# EAGLE design AAA_Battery_Shield (EAGLE 6.4)

## Sheet 1 of 2
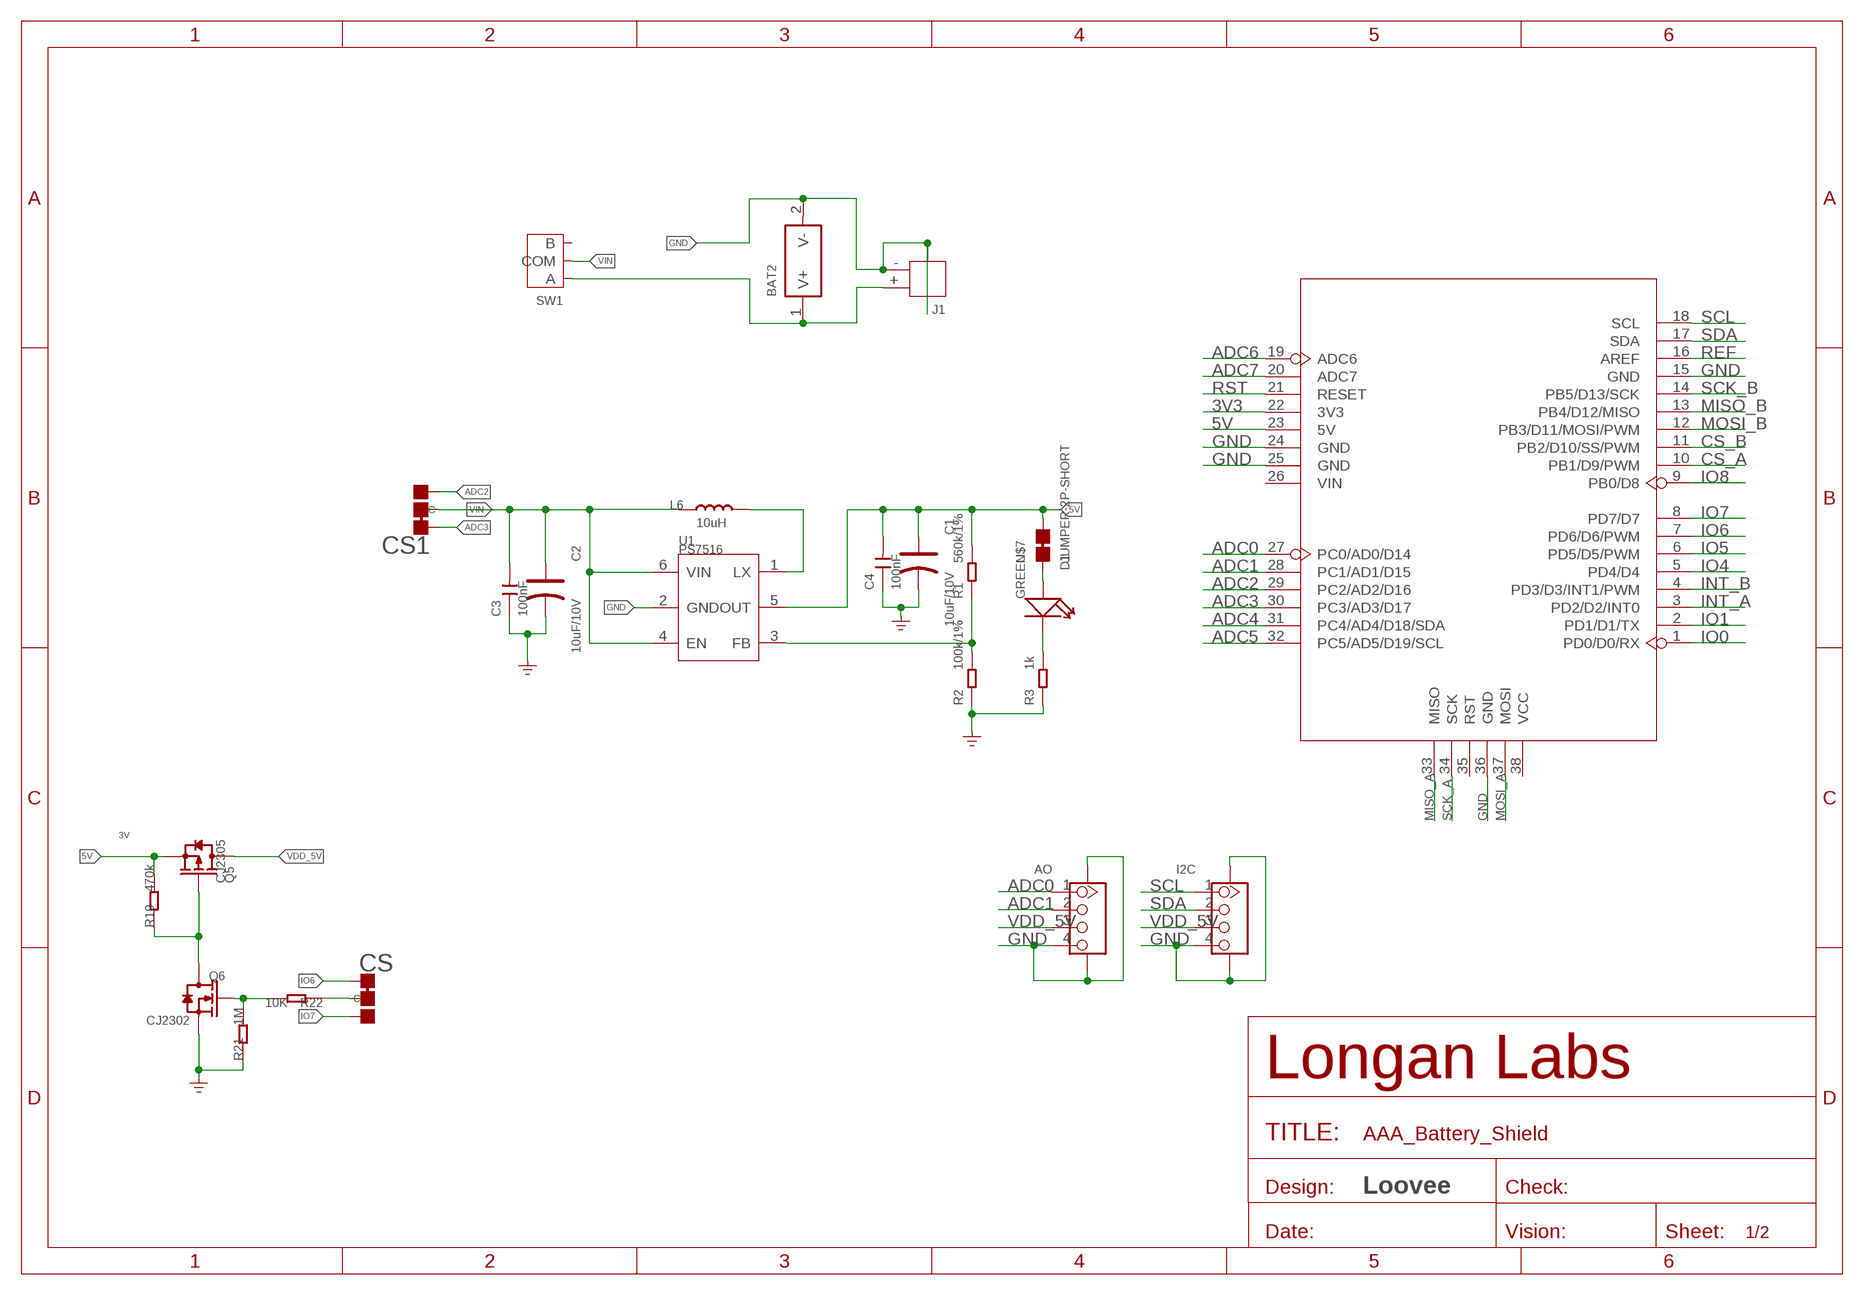
[diagram p0: schematic, sheet 1]

### Parts
AO  GROVE-CONNECTOR-SMD'90D'  [HW4-SMD-2.0-90D]
BAT2  BAT-HOLDER-BC2AAA  [BAT2P-12.5-51.8X24MM]
C1  10uF/10V  CAP-POLAR-AVX-B  [AVX-B]
C2  10uF/10V  CAP-POLAR-AVX-B  [AVX-B]
C3  100nF  CAP-0603  [C0603]
C4  100nF  CAP-0603  [C0603]
CS  JUMPER-3P-SHORT  [3P-SMD-SHORT]
CS1  JUMPER-3P-SHORT  [3P-SMD-SHORT]
D1  GREEN  LED'0603'  [LED-0603]
I2C  GROVE-CONNECTOR-SMD'90D'  [HW4-SMD-2.0-90D]
J1  JST-2P-SMD'2.0'  [HW2-SMD-2.0-90D]
L6  10uH  LSPD3D16-4R7M  [L0420]
Q5  CJ2305  MOSFET-P'SI2323CDS/SI2305DS<BR>'  [SOT-23]
Q6  CJ2302  MOSFET-N'SOT23'  [SOT-23]
R1  560k/1%  RES-0603  [R0603]
R2  100k/1%  RES-0603  [R0603]
R3  1k  RES-0603  [R0603]
R19  470k  RES-0603  [R0603]
R21  1M  RES-0603  [R0603]
R22  10K  RES-0603  [R0603]
SW1  SWITCH-2H-3P  [SW3-2.5-9X3.5MM]
U1  PS7516  PMIC-PS7516  [SOT-23-6]
U4  ARDUINO-38P'WITH/-SILK'  [ARDUINO-38P-WITH/-SILK-500519002]
U$7  JUMPER-2P-SHORT  [2P-SMD-SHORT]

### Nets
3V3: U4.22(3V3)
5V: C1.+ C4.2 Q5.2(S) R1.2 R19.2 U1.5(OUT) U4.23(5V) U$7.2
ADC0: AO.1 U4.27(PC0/AD0/D14)
ADC1: AO.2 U4.28(PC1/AD1/D15)
ADC2: CS1.00(R) U4.29(PC2/AD2/D16)
ADC3: CS1.11(L) U4.30(PC3/AD3/D17)
ADC4: U4.31(PC4/AD4/D18/SDA)
ADC5: U4.32(PC5/AD5/D19/SCL)
ADC6: U4.19(ADC6)
ADC7: U4.20(ADC7)
CS_A: U4.10(PB1/D9/PWM)
CS_B: U4.11(PB2/D10/SS/PWM)
GND: AO.4 AO.SS1 AO.SS2 BAT2.2(V-) C1.- C2.- C3.1 C4.1 I2C.4 I2C.SS1 I2C.SS2 J1.3 J1.4 J1.- Q6.2(S) R2.1 R3.1 R21.1 U1.2(GND) U4.15(GND) U4.24(GND) U4.25(GND) U4.36(GND) ; supply symbol labelled GND_POWER
INT_A: U4.3(PD2/D2/INT0)
INT_B: U4.4(PD3/D3/INT1/PWM)
IO0: U4.1(PD0/D0/RX)
IO1: U4.2(PD1/D1/TX)
IO4: U4.5(PD4/D4)
IO5: U4.6(PD5/D5/PWM)
IO6: CS.11(L) U4.7(PD6/D6/PWM)
IO7: CS.00(R) U4.8(PD7/D7)
IO8: U4.9(PB0/D8)
MISO_A: U4.33(MISO)
MISO_B: U4.13(PB4/D12/MISO)
MOSI_A: U4.37(MOSI)
MOSI_B: U4.12(PB3/D11/MOSI/PWM)
N$1: BAT2.1(V+) J1.+ SW1.1(A)
N$2: CS.MM(C) R22.1
N$3: D1.- R3.2
N$4: L6.2 U1.1(LX)
N$5: D1.+ U$7.1
N$7: R1.1 R2.2 U1.3(FB)
N$15: Q5.1(G) Q6.3(D) R19.1
N$20: Q6.1(G) R21.2 R22.2
REF: U4.16(AREF)
RST: U4.21(RESET)
SCK_A: U4.34(SCK)
SCK_B: U4.14(PB5/D13/SCK)
SCL: I2C.1 U4.18(SCL)
SDA: I2C.2 U4.17(SDA)
VDD_5V: AO.3 I2C.3 Q5.3(D)
VIN: C2.+ C3.2 CS1.MM(C) L6.1 SW1.2(COM) U1.4(EN) U1.6(VIN)
Unconnected: SW1.3(B) U4.26(VIN) U4.35(RST) U4.38(VCC)

### Notes on the sheet
- 3V
- Loovee

## Sheet 2 of 2

## Library data of the parts
AO I2C = Connector-new:GROVE-CONNECTOR-SMD: 4P-SMD-2.0:320110030;4P-SMD-2.0-90D:320110032
BAT2 = Connector-new:BAT-HOLDER: BAT2P-13.5-CR1220:320170002;BAT2P-SMD-20.5-CR1632:320170007;METAL-CR2032-D20.0*H6.3MM:320170003;METAL-CR2032-SMD:320170006;PLASTIC-CR1220-L15.06*W13.0*H4.1MM:320170000;PLASTIC-CR2032-L25.2*W15.6*H5.2MM:320170005;BAT2P-11.55-D12.55-CR1220:313010022
C1 C2 = Discrete-new:CAP-POLAR: Electrolytic Capacitors,Tantalum Capacitors and Super Capacitors
C3 C4 = Discrete-new:CAP: Ceramic Capacitors
CS CS1 = Discrete-new:JUMPER-3P-SHORT
D1 = Discrete-new:LED
J1 = Connector-new:JST-2P-SMD: 2P-SMD-1.0-90D:320110054;2P-SMD-2.0-90D:320110026
L6 = Discrete-new:L
Q5 = Discrete-new:MOSFET-P
Q6 = Discrete-new:MOSFET-N: IRLL014: http://www.vishay.com/docs/91319/sihll014.pdf
R1-R3 R19 R21 R22 = Discrete-new:RES
SW1 = SWITCH:SWITCH-2H-3P
U1 = Longan-IC:PMIC-PS7516
U4 = moudle:ARDUINO-38P
U$7 = Discrete-new:JUMPER-2P-SHORT

## Board
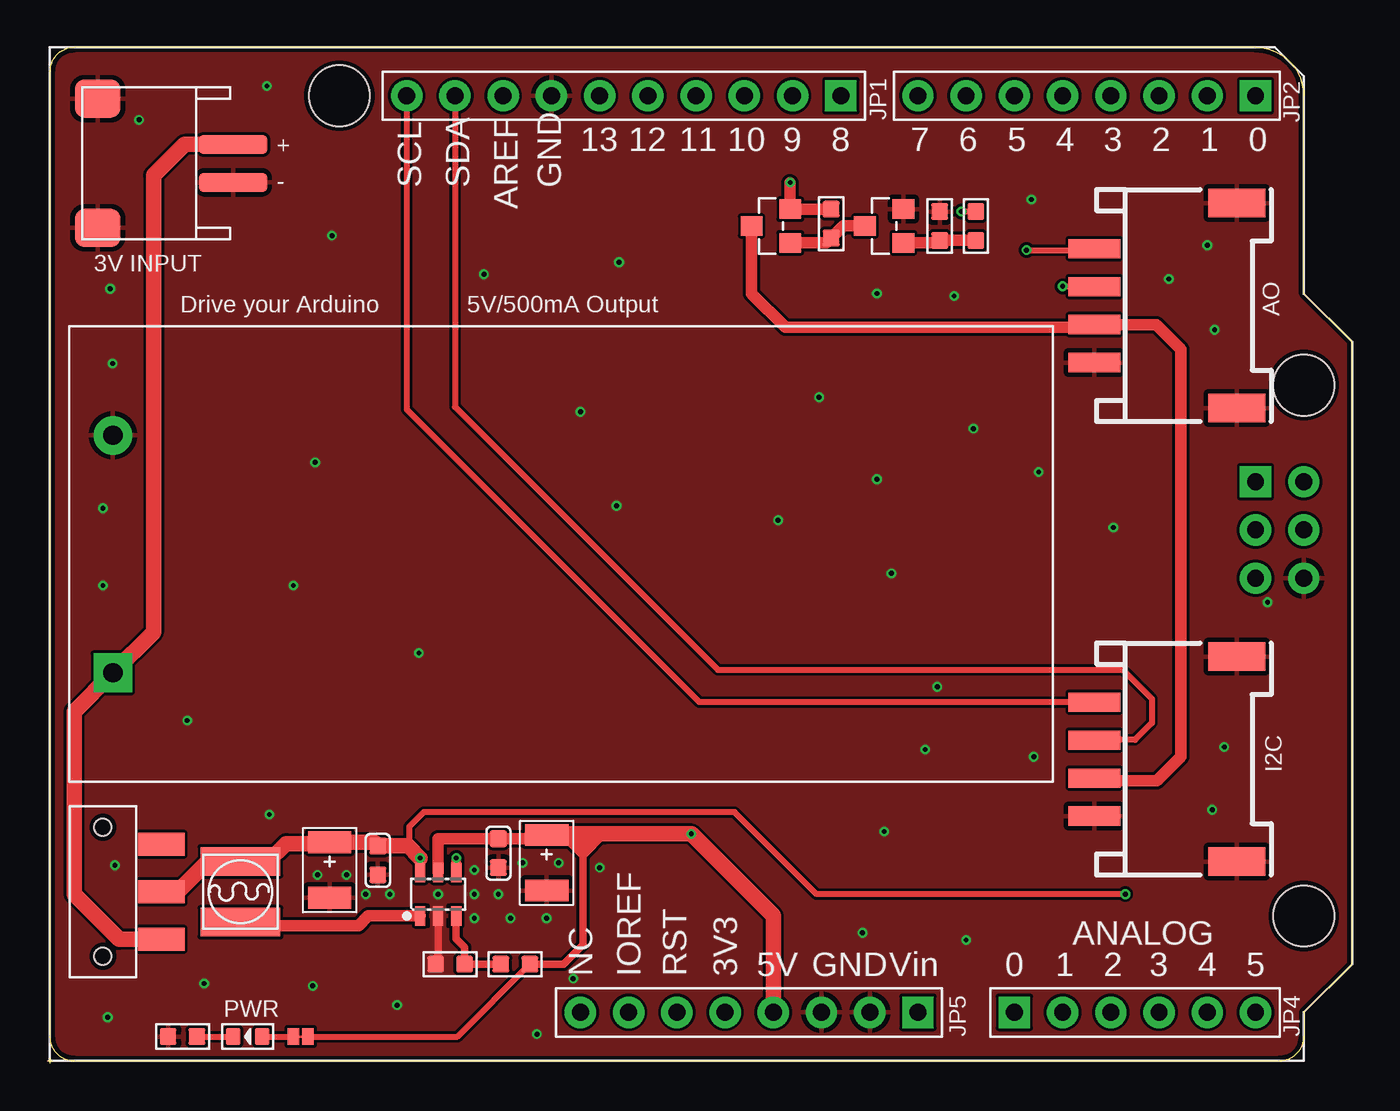
[diagram p1: board, top side]
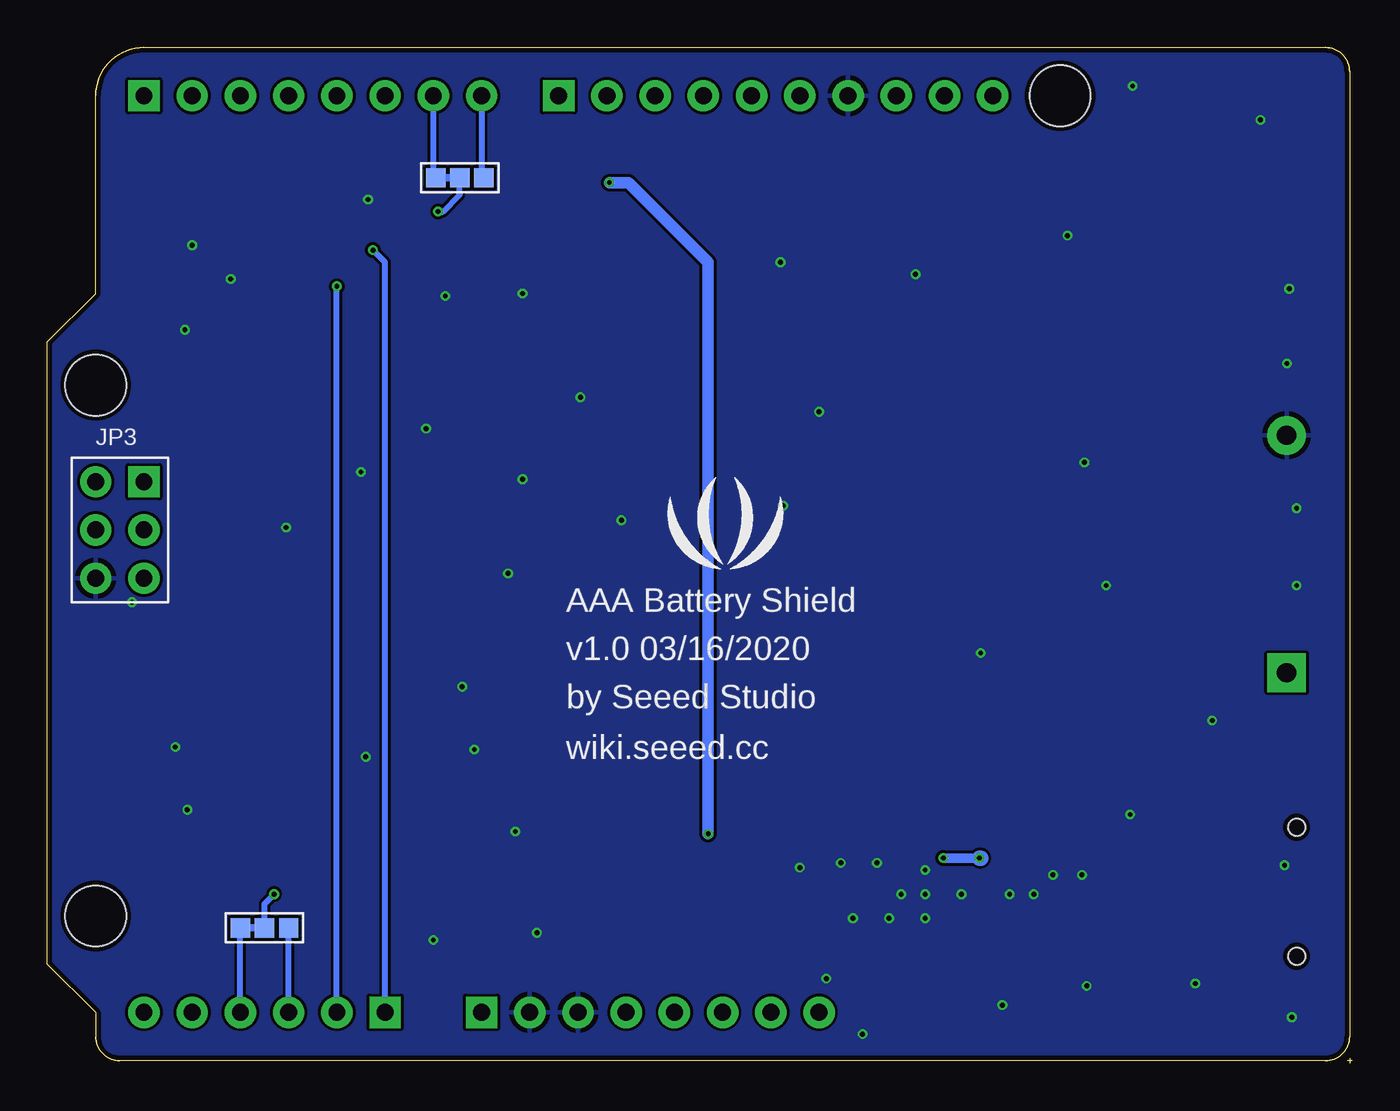
[diagram p2: board, bottom side, seen from below]

Size 68.71 x 53.47 mm. Coordinates in mm from the lower left corner, seen from the top.
Outline: 66.17,1.4 arc-90 64.9,0.13
Outline: 1.4,0.13 arc-90 0.13,1.4
Outline: 0.13,52.2 arc-90 1.4,53.47
Outline: 63.63,53.47 arc-90 66.17,50.93
Outline: 0.13,1.4 arc90 1.4,0.13
Outline: 64.9,0.13 arc90 66.17,1.4
Outline: 1.4,53.47 arc90 0.13,52.2
Outline: 0.13,1.4 arc90 1.4,0.13
Outline: 64.9,0.13 arc90 66.17,1.4
Outline: 66.17,50.93 arc90 63.63,53.47
Outline: 66.17,1.4 66.17,2.67 68.71,5.21 68.71,37.97 66.17,40.51 66.17,50.93
Outline: 66.17,1.4 arc-90 64.9,0.13
Outline: 63.63,53.47 1.4,53.47
Outline: 1.4,53.47 arc90 0.13,52.2
Outline: 0.13,52.2 0.13,1.4
Outline: 0.13,1.4 arc90 1.4,0.13
Outline: 66.17,50.93 arc90 63.63,53.47
Outline: 1.4,0.13 64.9,0.13
Outline: 0,0.13 0.25,0.13
Outline: 0.13,0.25 0.13,0
Copper layers (1*16): Top 0.035mm / dielectric 1.5mm / Bottom 0.035mm
Design rules "SeeedStudio_2layer_DRU_no_angle_20140221": minimum track width 1mil, minimum drill 10mil, track to track 6mil, track to pad 6mil, pad to pad 6mil, via to via 6mil, smd to smd 0mil, copper to edge 10mil, drill to drill 10mil, minimum pad ring 4mil, minimum via ring 4mil, stop-mask expansion 2mil, vias tented up to drill 25mil, thermal gap 10mil
tRestrict: area -11.2,6.1 to -6.7,6.9

### Footprints (pad centres in the part's own frame; a part is rotated, then mirrored left to right if it is on the bottom)
HW4-SMD-2.0-90D = smd 1.01 x 2.74: 1 -3,-0.1; 2 -1,-0.1; 3 1,-0.1; 4 3,-0.1 | smd 1.5 x 3: SS1 -5.4,7.4; SS2 5.4,7.4
BAT2P-12.5-51.8X24MM = drill 1.016 pad 2.032 square: 1 -2.3,6.25 | drill 1.016 pad 2.032: 2 -2.3,-6.25
AVX-B = smd 1.143 x 2.286: + -1.46,0; - 1.46,0
C0603 = smd 0.889 x 0.889: 1 0,0.762; 2 0,-0.762
3P-SMD-SHORT = smd 1.016 x 1.016: 00 -1.27,0; 11 1.27,0; MM 0,0
LED-0603 = smd 0.762 x 0.889: + -0.762,0; - 0.762,0
HW2-SMD-2.0-90D = smd 2 x 2.4: 3 3.4,-2.181; 4 -3.4,-2.181 | smd 1 x 3.6: + -1,4.953; - 1,4.953
L0420 = smd 1.5 x 4.2: 1 -1.6,0; 2 1.6,0
SOT-23 = smd 1.143 x 1.016: 1 1.016,-0.889; 2 1.016,0.889; 3 -1.016,0
R0603 = smd 0.889 x 0.889: 1 -0.762,0; 2 0.762,0
SW3-2.5-9X3.5MM = smd 1.2 x 2.45: 1 -2.5,-3.075; 2 0,-3.075; 3 2.5,-3.075 | hole 0.9: -3.4,0; 3.4,0
SOT-23-6 = smd 0.55 x 1.016: 1 -0.95,-1.143; 2 0,-1.143; 3 0.95,-1.143; 4 0.95,1.143; 5 0,1.143; 6 -0.95,1.143
ARDUINO-38P-WITH/-SILK-500519002 = drill 0.889 pad 1.651 square: 1 63.5,50.8; 9 41.656,50.8; 26 45.72,2.54; 27 50.8,2.54; 33 63.5,30.48 | drill 0.889 pad 1.651: 2 60.96,50.8; 3 58.42,50.8; 4 55.88,50.8; 5 53.34,50.8; 6 50.8,50.8; 7 48.26,50.8; 8 45.72,50.8; 10 39.116,50.8; 11 36.576,50.8; 12 34.036,50.8; 13 31.496,50.8; 14 28.956,50.8; 15 26.416,50.8; 16 23.876,50.8; 17 21.336,50.8; 18 18.796,50.8; 19 27.94,2.54; 20 30.48,2.54; 21 33.02,2.54; 22 35.56,2.54; 23 38.1,2.54; 24 40.64,2.54; 25 43.18,2.54; 28 53.34,2.54; 29 55.88,2.54; 30 58.42,2.54; 31 60.96,2.54; 32 63.5,2.54; 34 63.5,27.94; 35 63.5,25.4; 36 66.04,25.4; 37 66.04,27.94; 38 66.04,30.48 | hole 3.2: 15.24,50.8; 66.04,35.56; 66.04,7.62
2P-SMD-SHORT = smd 0.889 x 0.61: 1 0,0.381; 2 0,-0.381

### Placement (x,y rotation side)
AO  55.25,39.88 270 top
BAT2  1.14,26.8 180 top
C1  26.29,10.54 270 top
C2  14.86,10.16 270 top
C3  17.4,10.67 180 top
C4  23.75,11.05 180 top
CS  46.99,46.61 180 bottom
CS1  57.28,7.11 180 bottom
D1  10.54,1.4 180 top
I2C  55.25,16 270 top
J1  4.83,47.37 270 top
L6  10.16,9.02 270 top
Q5  38.1,44.07 0 top
Q6  44.07,44.07 0 top
R1  24.64,5.21 0 top
R2  21.21,5.21 0 top
R3  7.11,1.4 0 top
R19  41.28,44.2 90 top
R21  46.99,44.07 270 top
R22  48.9,44.07 270 top
SW1  2.92,9.02 90 top
U1  20.57,8.89 0 top
U4  0.13,0.13 0 top
U$1  [LOGO_SILK]  33.02,27.69 0 bottom
U$7  13.34,1.4 90 top

### Tracks (layer width: path | path; a pad name or v marks a point on that pad's centre or on a via)
5V  (via drill 0.25 pad 0.51)
  Top 0.305: U$7.2 21.59,1.4 R1.2
  Top 0.406: 28.19,10.92 28.19,6.22 27.18,5.21 R1.2 | 28.19,10.92 28.19,11.3 | 28.19,11.3 28.19,11.43 | 28.19,11.43 28.19,11.94 28.07,12.07 | 27.18,11.81 26.48,11.81 C1.+ | 28.19,10.92 27.05,12.07 | 28.19,10.92 29.34,12.07 | 28.19,11.3 27.69,11.81 | 28.19,11.43 28.32,11.43 28.7,11.81
  Top 0.61: R19.2 Q5.2 v39.12,46.36 | U1.5 20.57,11.81 C4.2 26.1,11.81 C1.+
  Top 0.813: C1.+ 26.35,12.07 27.05,12.07 28.07,12.07 29.34,12.07 v33.91,12.07 38.23,7.75 U4.23
  Bottom 0.61: v39.12,46.36 38.1,46.36 33.91,42.16 v33.91,12.07
ADC0  (via drill 0.25 pad 0.51)
  Top 0.305: v51.56,42.8 55.07,42.8 AO.1
  Bottom 0.305: U4.27 50.93,42.16 v51.56,42.8
ADC1  (via drill 0.25 pad 0.51)
  Top 0.305: v53.47,40.89 55.13,40.89 AO.2
  Bottom 0.305: U4.28 v53.47,40.89
ADC2
  Bottom 0.305: U4.29 CS1.00
ADC3
  Bottom 0.305: U4.30 CS1.11
GND  (via drill 0.25 pad 0.51)
  Top 0.406: U1.2 20.57,5.84 R2.1
  other vias: 20.57,8.89 16.76,8.89 15.75,9.91 14.22,9.91 18.03,8.89 22.48,10.16 26.29,7.62 24.38,7.62 22.48,7.62 23.75,8.89 26.92,10.54 25.02,10.54 22.48,8.89 52.2,31.11 29.08,10.29 27.69,4.44 13.97,4.06 8.26,4.19 61.34,13.34 51.94,16.13 64.26,24.26 11.68,13.08 2.92,25.15 2.92,29.21 3.43,36.83 3.3,40.77 19.56,21.59 22.99,41.53 28.07,34.29 30.1,42.16 43.69,40.51 47.75,40.39 51.82,45.47 61.09,43.05 61.47,38.61 56.13,28.19 61.98,16.64 48.39,6.48 44.07,12.19 18.41,3.05 25.78,1.52 3.17,2.41 7.37,18.03 12.95,25.15 14.1,31.62 14.99,43.56 4.83,49.66 11.56,51.44 3.56,10.41 42.93,6.86 46.23,16.51 46.86,19.81 59.05,41.28 43.69,30.73 38.48,28.57 40.64,35.05 48.77,33.4 44.45,25.78 29.97,29.34
  pour Top (isolate 0.254, rank 6, no thermals): 19.3,8.89 21.21,8.89 21.21,4.57 19.3,4.57
  pour Bottom: -0.25,53.85 70.1,53.85 70.1,-0.25 -0.25,-0.25
  pour Top: -0.64,54.1 70.61,54.1 70.61,-0.76 -0.89,-0.76 -0.89,54.1
IO6
  Bottom 0.305: U4.7 48.39,46.74 CS.11
IO7
  Bottom 0.305: U4.8 45.85,46.74 CS.00
N$1
  Top 0.813: SW1.1 3.77,6.52 1.4,8.89 1.4,18.5 BAT2.1 5.59,22.69 5.59,46.74 7.22,48.37 J1.+
N$2  (via drill 0.25 pad 0.51)
  Top 0.305: R22.1 v48.13,44.83
  Bottom 0.305: v48.13,44.83 47.88,44.83 46.99,45.72 CS.MM
N$3
  Top 0.305: R3.2 D1.-
N$4
  Top 0.61: U1.1 16.89,7.75 16.38,7.24 11.3,7.24 11.05,7.49 10.24,7.49 L6.2
N$5
  Top 0.305: D1.+ U$7.1
N$7
  Top 0.406: U1.3 21.52,6.54 21.97,6.1 R2.2 R1.1
N$15
  Top 0.61: Q5.1 41.02,43.18 R19.1 41.91,44.07 Q6.3
N$20
  Top 0.61: Q6.1 46.86,43.18 R21.2 R22.2
SCL
  Top 0.305: I2C.1 34.34,19 19.56,33.78 19.3,34.04 18.92,34.42 U4.18
SDA
  Top 0.305: U4.17 21.46,34.54 35.31,20.7 56.64,20.7 58.17,19.18 58.17,17.91 57.28,17.02 55.16,17.02 I2C.2
VDD_5V
  Top 0.61: I2C.3 55.29,14.86 58.42,14.86 59.69,16.13 59.69,37.59 58.4,38.88 AO.3 55,38.73 38.86,38.73 37.08,40.51 Q5.3
VIN  (via drill 0.25 pad 0.51)
  Top 0.305: v56.77,8.89 40.51,8.89 36.2,13.21 19.81,13.21 19.05,12.45 19.05,11.49 18.99,11.43
  Top 0.508: U1.4 v21.52,10.79 v21.53,10.79 | v19.62,10.79 U1.6
  Top 0.813: SW1.2 6.86,9.02 8.38,10.54 10.08,10.54 L6.1 11.63,10.62 12.57,11.56 14.79,11.56 C2.+ 17.21,11.62 C3.2 18.99,11.43 v19.62,10.79
  Bottom 0.305: 58.55,7.11 57.4,7.11 57.28,7.24 57.28,8.38 v56.77,8.89
  Bottom 0.508: v21.53,10.79 v19.62,10.79
  Bottom 0.813: v19.62,10.79 19.56,10.79

### Text on the board
tPlace: + | - | 3V INPUT | Drive your Arduino | 5V/500mA Output | PWR
bPlace: AAA Battery Shield | v1.0 03/16/2020 | by Seeed Studio | wiki.seeed.cc